# Altium schematic sheet Ethernet.SchDoc
size A4
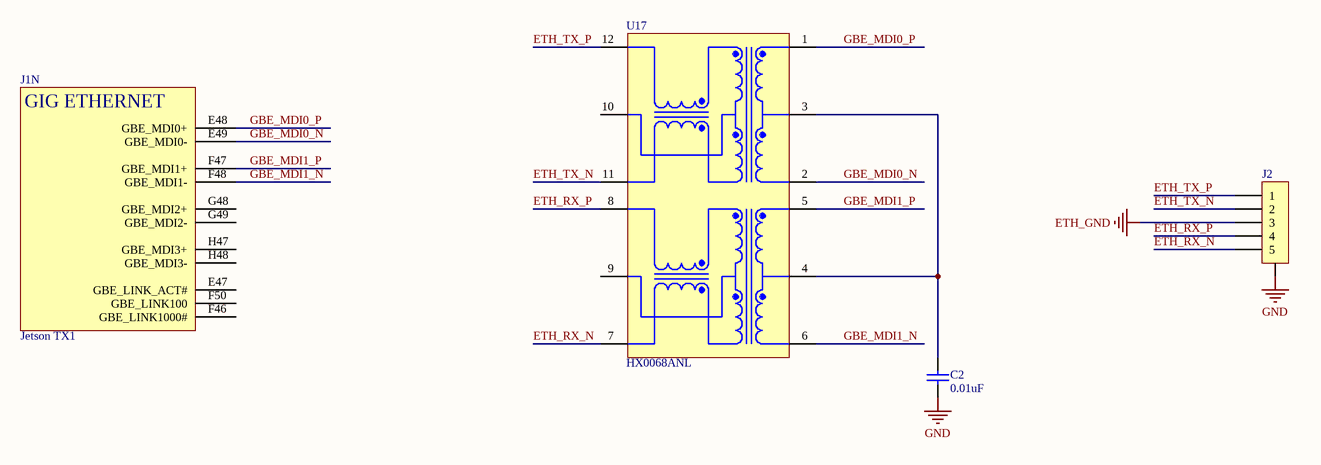
[diagram p0: Ethernet.SchDoc]

## Parts
C2  value 0.01uF  [0402C_M]  (hidden comment: GRM155R71H103KA88D)
J1  Jetson TX1  [Nvidia Jetson TX1]  (part N of 14)
J2  SM05B-GHS-TB(LF)(SN)  [SM05B-GHS-TB]  (value not drawn)
U17  HX0068ANL  [PULS-HX0068ANL_V]

## Nets
ETH_GND: J2.3
GND: C2.1 J2.0
ETH_RX_N: J2.5 U17.7(TX-)
ETH_RX_P: J2.4 U17.8(TX+)
ETH_TX_N: J2.2 U17.11(RX-)
ETH_TX_P: J2.1 U17.12(RX+)
GBE_MDI0_N: J1.E49(GBE_MDI0-) U17.2(RD-)
GBE_MDI0_P: J1.E48(GBE_MDI0+) U17.1(RD+)
GBE_MDI1_N: J1.F48(GBE_MDI1-) U17.6(TD-)
GBE_MDI1_P: J1.F47(GBE_MDI1+) U17.5(TD+)
NetC2_2: C2.2 U17.3(RDCT) U17.4(TDCT)

Not connected (* = marked no-connect by the designer): J1 E47(GBE_LINK_ACT#) F46(GBE_LINK1000#) F50(GBE_LINK100) G48(GBE_MDI2+) G49(GBE_MDI2-) H47(GBE_MDI3+) H48(GBE_MDI3-); U17 9(TXCT) 10(RXCT)

## Notes on the sheet
- (in symbol NVIDIA_Jetson_TX1, part N) GIG ETHERNET

## Library data of the parts
C2 = GRM155R71H103KA88D: CAP CER 0.01uF 50V X7R 0402; Manufacturer: Murata Electronics North America; Tolerance: ±10%; Supplier 1: Digi-Key; Manufacturer Part Number: GRM155R71H103KA88D; RoHS: RoHS Compliant; Category: Capacitors; Stock 1: 10436079; Pricing 1: 1=0.1, 10=0.011, 100=0.005, 500=0.00354, 1000=0.00278, 2500=0.00253, 5000=0.00233 (USD); Packaging: Cut Tape (CT); Part Status: Active; Voltage - Rated: 50V; Temperature Coefficient: X7R; Operating Temperature: -55°C ~ 125°C; Features: -; Ratings: -; Applications: General Purpose; Mounting Type: Surface Mount, MLCC; Package / Case: 0402 (1005 Metric); Size / Dimension: 0.039" L x 0.020" W (1.00mm x 0.50mm); Height - Seated (Max): -; Thickness (Max): 0.022" (0.55mm); Lead Spacing: -; Lead Style: -; ComponentLink1URL: http://www.murata.com/~/media/webrenewal/support/library/catalog/products/capacitor/mlcc/c02e.pdf; ComponentLink1Description: http://www.murata.com/~/media/webrenewal/support/library/catalog/products/capacitor/mlcc/c02e.pdf; Supplier Part Number 1: 490-4516-1-ND
J1 = NVIDIA_Jetson_TX1: Nvidia computing module
J2 = SM05B-GHS-TB(LF)(SN): CONN HEADER GH SIDE 5POS 1.25MM; Manufacturer: JST Sales America Inc.; Pitch - Mating: 0.049" (1.25mm); Number of Positions: 5; Number of Positions Loaded: All; Style: Board to Cable/Wire; Shrouding: Shrouded - 4 Wall; Material Flammability Rating: UL94 V-0; Current Rating: 1A; Voltage Rating: 50V; Mated Stacking Heights: 4.35mm; Supplier 1: Digi-Key; Manufacturer Part Number: SM05B-GHS-TB(LF)(SN); RoHS: RoHS Compliant; Category: Connectors, Interconnects; Stock 1: 49982; Pricing 1: 1=0.48, 10=0.445, 100=0.3415, 500=0.29698, 1000=0.24501 (USD); Packaging: Cut Tape (CT); Part Status: Active; Connector Type: Header; Contact Type: Outer Shroud Contact; Number of Rows: 1; Row Spacing - Mating: -; Mounting Type: Surface Mount, Right Angle; Termination: Solder; Fastening Type: Locking Ramp; Contact Length - Mating: -; Contact Length - Post: -; Overall Contact Length: -; Insulation Height: 0.167" (4.25mm); Contact Shape: Rectangular; Contact Finish - Mating: Tin; Contact Finish Thickness - Mating: -; Contact Finish - Post: Tin; Contact Material: Phosphor Bronze; Insulation Material: Polyamide (PA9T), Nylon 9T; Features: Solder Retention; Operating Temperature: -25°C ~ 85°C; Ingress Protection: -; Insulation Color: Natural; Contact Finish Thickness - Post: -; Applications: -; ComponentLink1URL: http://www.jst-mfg.com/product/pdf/eng/eGH.pdf; ComponentLink1Description: http://www.jst-mfg.com/product/pdf/eng/eGH.pdf; Supplier Part Number 1: 455-1567-1-ND
U17 = CMP-2000-06430-1: 10 / 100 PC Card LAN Magnetic Module, -40 to 85 degC, 12-Pin SMD, RoHS, Tube; Isolation Voltage: 1.5kV; Brand: Pulse; Frequency Range: 100kHzto100MHz; Number of Channels: Single; Packaging: Tube; Datasheet URL: https://productfinder.pulseeng.com/doc_type/WEB301/doc_num/H304/doc_part/H304.pdf; Operating Temperature Range: -40Cto+85C; Product: LAN; Product Type: 10/100PCCardLanMagneticModule; Package Description: 12-Pin Surface Mount Device, Body 12.7 x 8.814 mm, Pitch 1.27 mm; Type: Module; Application: 10/100PCCard; RoHS: True; Width: 9.652mm; Datasheet Version: 10/2013; Product Category: Audio&SignalTransformers; Mounting Technology: SurfaceMount; Length: 12.7mm; Manufacturer: Pulse; Package Reference: HX0068ANL; Height: 2.083mm; Manufacturer URL: http://www.pulseelectronics.com/; Termination Style: SMD/SMT